# EAGLE design 42Board (EAGLE 9.6.2)
COMPANY: ADAFRUIT INDUSTRIES; DRAWN: KTOWN; REV: B
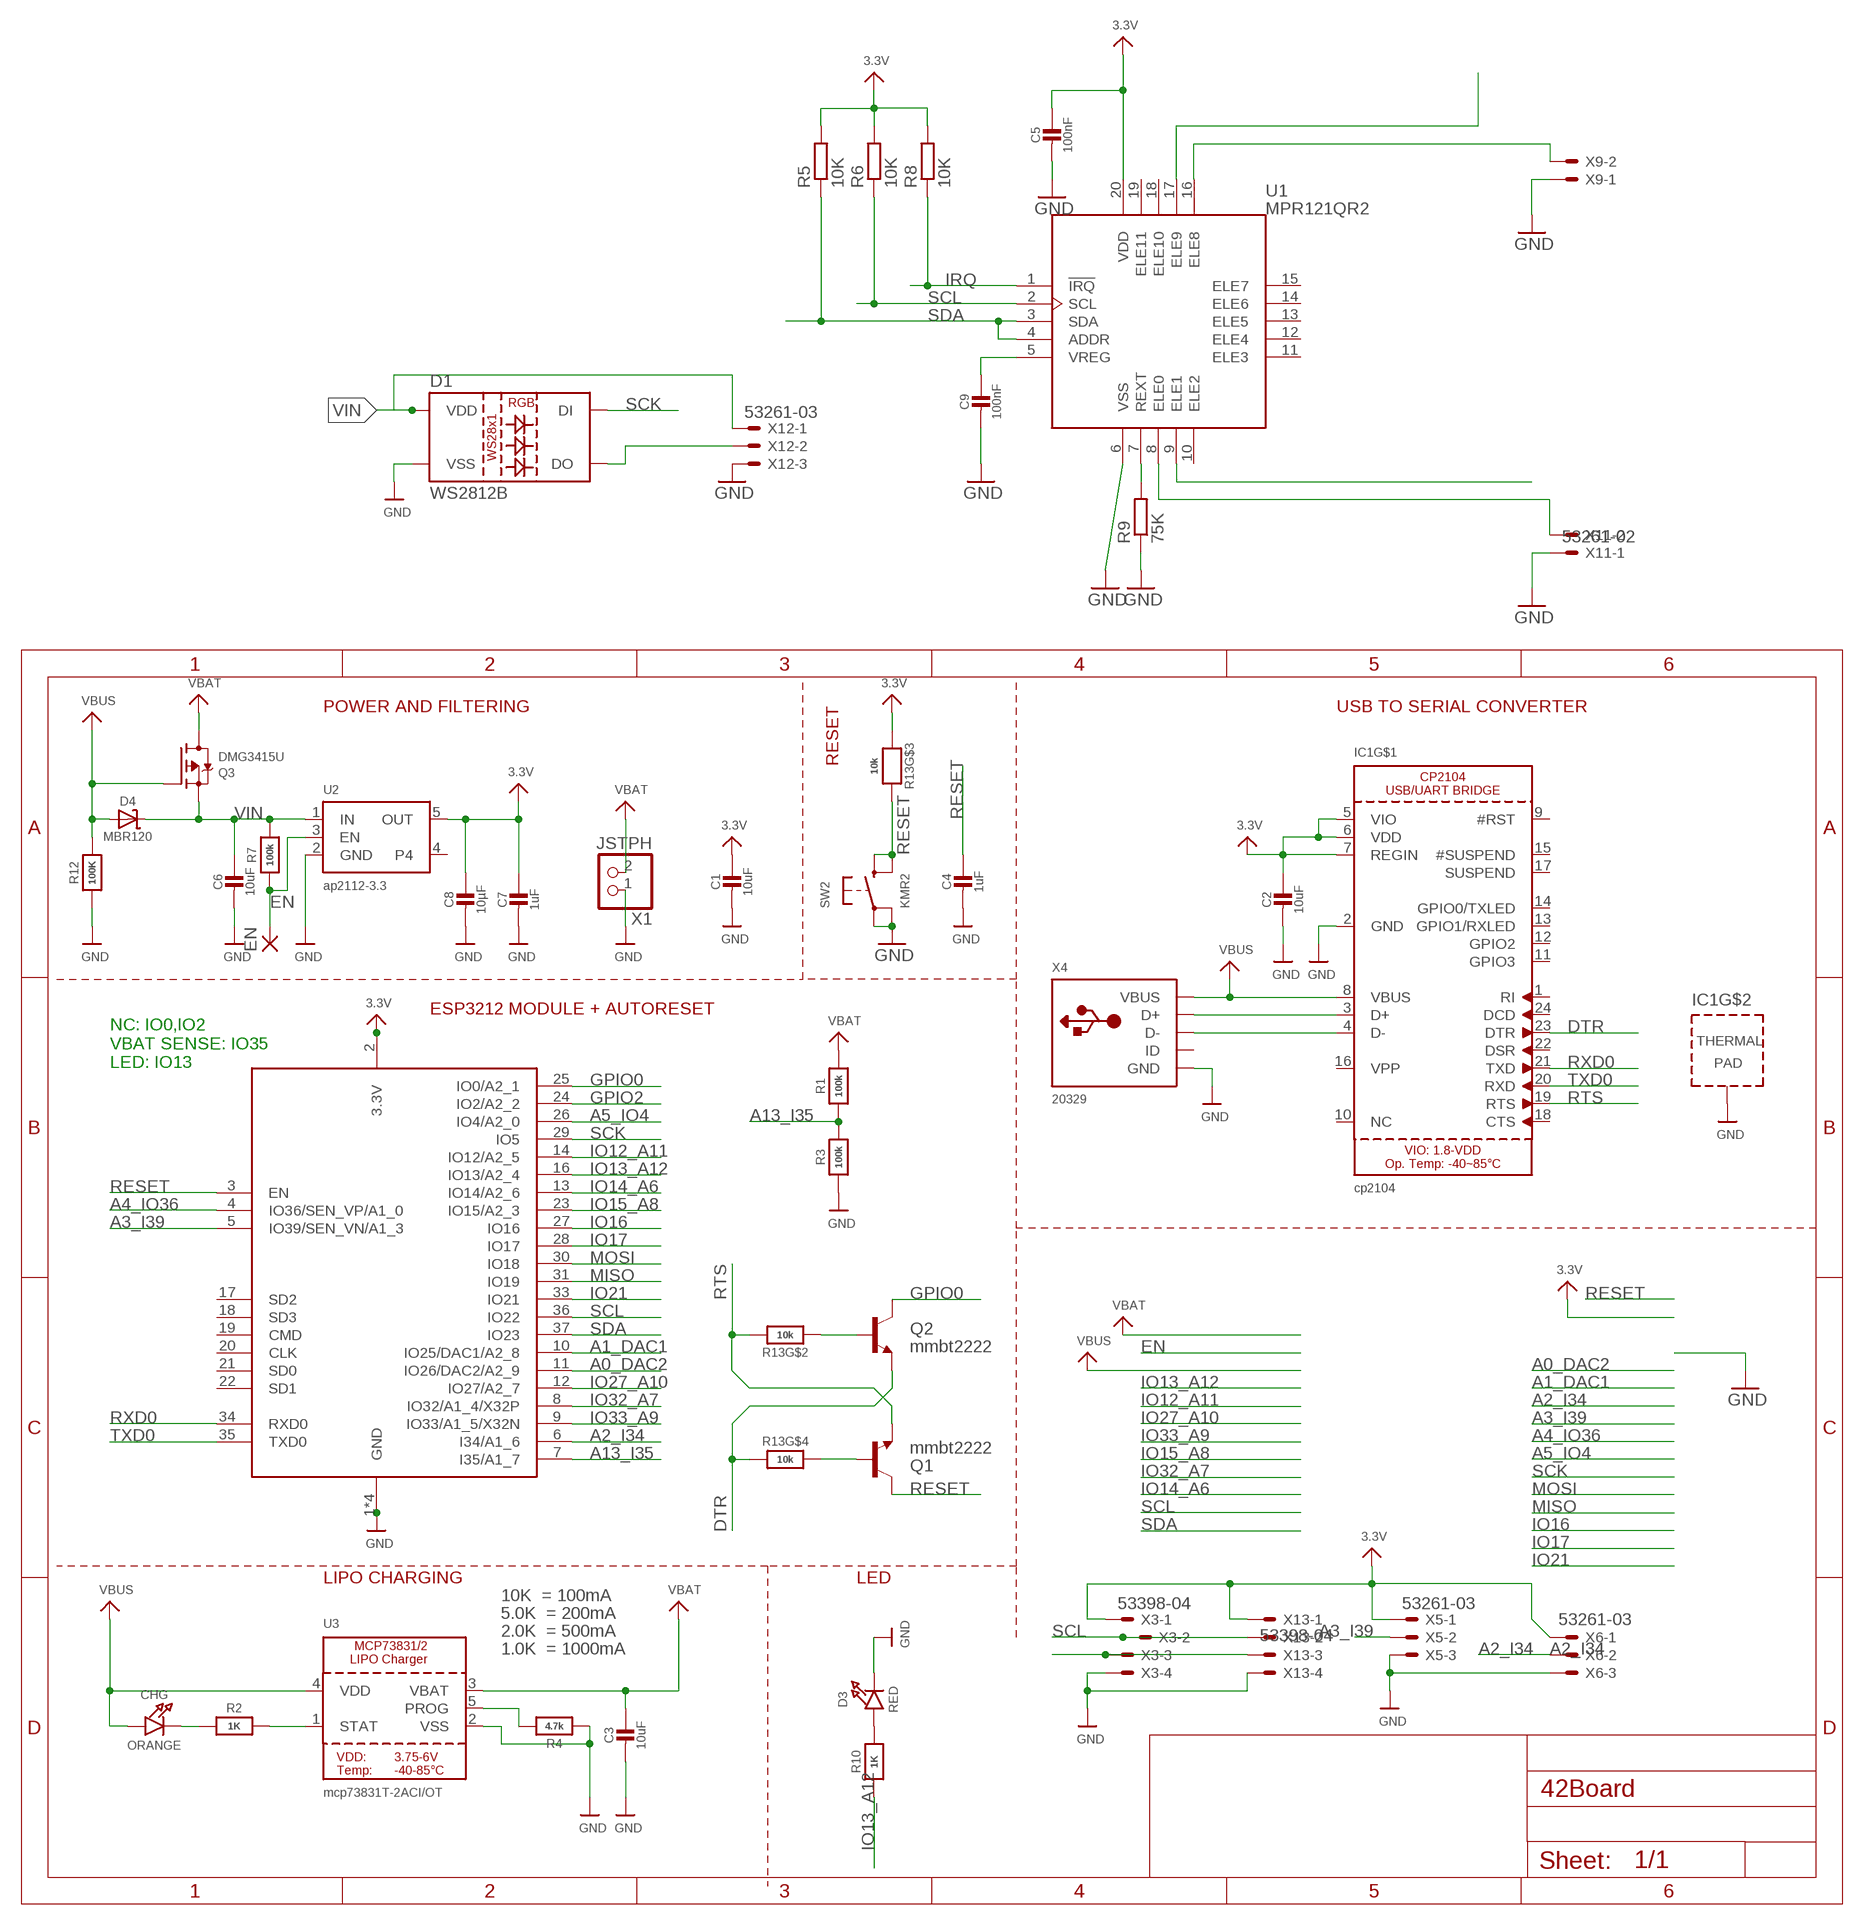
[diagram p0: schematic, sheet 1]

## Parts
C1  10uF  CAP_CERAMIC0805-NOOUTLINE  [0805-NO]
C2  10uF  CAP_CERAMIC0805-NOOUTLINE  [0805-NO]
C3  10uF  CAP_CERAMIC0805-NOOUTLINE  [0805-NO]
C4  1uF  CAP_CERAMIC0603_NO  [0603-NO]
C5  100nF  CAP_CERAMIC0603_NO  [0603-NO]
C6  10uF  CAP_CERAMIC0805-NOOUTLINE  [0805-NO]
C7  1uF  CAP_CERAMIC0603_NO  [0603-NO]
C8  10µF  CAP_CERAMIC0805-NOOUTLINE  [0805-NO]
C9  100nF  CAP_CERAMIC0603_NO  [0603-NO]
CHG  ORANGE  LED0805_NOOUTLINE  [CHIPLED_0805_NOOUTLINE]
D1  WS2812B  [WS2812B]
D3  RED  LED0805_NOOUTLINE  [CHIPLED_0805_NOOUTLINE]
D4  MBR120  DIODE-SCHOTTKYSOD-123  [SOD-123]
EN  1,6/0,8  [1,6/0,8]
IC1  cp2104  CP2104  [QFN24_4MM_SMSC]
Q1  mmbt2222  TRANSISTOR_NPNSOT23-3  [SOT23-3]
Q2  mmbt2222  TRANSISTOR_NPNSOT23-3  [SOT23-3]
Q3  DMG3415U  MOSFET-P  [SOT23-R]
R1  100k  RESISTOR_0603_NOOUT  [0603-NO]
R2  1K  RESISTOR_0603_NOOUT  [0603-NO]
R3  100k  RESISTOR_0603_NOOUT  [0603-NO]
R4  4.7k  RESISTOR_0603_NOOUT  [0603-NO]
R5  10K  R-EU_R0603  [R0603]
R6  10K  R-EU_R0603  [R0603]
R7  100k  RESISTOR_0603_NOOUT  [0603-NO]
R8  10K  R-EU_R0603  [R0603]
R9  75K  R-EU_R0603  [R0603]
R10  1K  RESISTOR_0603_NOOUT  [0603-NO]
R12  100K  RESISTOR_0603_NOOUT  [0603-NO]
R13  10k  RESISTOR_4PACK  [RESPACK_4X0603]
SW2  KMR2  SWITCH_TACT_SMT4.6X2.8  [BTN_KMR2_4.6X2.8]
U1  MPR121QR2  [UFQFN-20]
U2  ap2112-3.3  VREG_SOT23-5  [SOT23-5]
U3  mcp73831T-2ACI/OT  MCP73831/2  [SOT23-5]
X1  JSTPH  CON_JST_PH_2PIN  [JSTPH2]
X2  ESP32_WROOM32_SKINNY  [WROOM32_SKINNY]
X3  53398-04  [53398-04]
X4  20329  USB_MICRO_20329_V2  [4UCONN_20329_V2]
X5  53261-03  [53261-03]
X6  53261-03  [53261-03]
X9  53261-02  [53261-02]
X11  53261-02  [53261-02]
X12  53261-03  [53261-03]
X13  53398-04  [53398-04]

## Nets
3.3V: C1.1 C2.1 C5.1 C7.1 C8.1 IC1.5(VIO) IC1.6(VDD) IC1.7(REGIN) R5.2 R6.2 R8.2 R13.3 U1.20(VDD) U2.5(OUT) X2.2(3.3V) X3.1 X5.1 X6.1 X13.1
A0_DAC2: X2.11(IO26/DAC2/A2_9)
A1_DAC1: X2.10(IO25/DAC1/A2_8)
A2_I34: X2.6(I34/A1_6) X6.2
A3_I39: X2.5(IO39/SEN_VN/A1_3) X5.2
A4_IO36: X2.4(IO36/SEN_VP/A1_0)
A5_IO4: X2.26(IO4/A2_0)
A13_I35: R1.1 R3.2 X2.7(I35/A1_7)
DTR: IC1.23(DTR) Q2.2(E) R13.4
EN: EN.1(P) R7.1 U2.3(EN)
GND: C1.2 C2.2 C3.2 C4.2 C5.2 C6.2 C7.2 C8.2 C9.2 D1.3(VSS) D3.C IC1.2(GND) IC1.THERM(TP) R3.1 R4.1 R9.1 R12.1 SW2.A'(P1) SW2.A(P) U1.6(VSS) U2.2(GND) U3.2(VSS) X1.1 X2.1(GND) X2.15(GND) X2.38(GND) X2.P$1(GND) X3.4 X4.BASE@1(GND) X4.BASE@2(GND) X4.GND X4.SPRT@1(GND) X4.SPRT@2(GND) X4.SPRT@3(GND) X4.SPRT@4(GND) X5.3 X6.3 X9.1 X11.1 X12.3 X13.4
GPIO0: Q2.3(C) X2.25(IO0/A2_1)
GPIO2: X2.24(IO2/A2_2)
IO12_A11: X2.14(IO12/A2_5)
IO13_A12: R10.1 X2.16(IO13/A2_4)
IO14_A6: X2.13(IO14/A2_6)
IO15_A8: X2.23(IO15/A2_3)
IO16: X2.27(IO16)
IO17: X2.28(IO17)
IO21: X2.33(IO21)
IO27_A10: X2.12(IO27/A2_7)
IO32_A7: X2.8(IO32/A1_4/X32P)
IO33_A9: X2.9(IO33/A1_5/X32N)
IRQ: R8.1 U1.1(!IRQ)
MISO: X2.31(IO19)
MOSI: X2.30(IO18)
N$1: CHG.C R2.1
N$2: IC1.3(D+) X4.D+
N$3: R2.2 U3.1(STAT)
N$4: R4.2 U3.5(PROG)
N$5: D3.A R10.2
N$6: IC1.4(D-) X4.D-
N$7: D1.2(DO) X12.2
N$8: R9.2 U1.7(REXT)
N$9: U1.8(ELE0) X11.2
N$10: C9.1 U1.5(VREG)
N$11: U1.9(ELE1)
N$12: Q1.1(B) R13.5
N$13: Q2.1(B) R13.2
N$14: U1.16(ELE8) X9.2
N$15: U1.17(ELE9)
RESET: C4.1 Q1.3(C) R13.6 SW2.B'(S1) SW2.B(S) X2.3(EN)
RTS: IC1.19(RTS) Q1.2(E) R13.7
RXD0: IC1.21(TXD) X2.34(RXD0)
SCK: D1.4(DI) X2.29(IO5)
SCL: R6.1 U1.2(SCL) X2.36(IO22) X3.2 X13.2
SDA: R5.1 U1.3(SDA) U1.4(ADDR) X2.37(IO23) X3.3 X13.3
TXD0: IC1.20(RXD) X2.35(TXD0)
VBAT: C3.1 Q3.3(D) R1.2 U3.3(VBAT) X1.2
VBUS: CHG.A D4.A IC1.8(VBUS) Q3.1(G) R12.2 U3.4(VDD) X4.VBUS
VIN: C6.1 D1.1(VDD) D4.C Q3.2(S) R7.2 U2.1(IN) X12.1
Unconnected: IC1.1(RI) IC1.9(#RST) IC1.10(NC) IC1.11(GPIO3) IC1.12(GPIO2) IC1.13(GPIO1/RXLED) IC1.14(GPIO0/TXLED) IC1.15(#SUSPEND) IC1.16(VPP) IC1.17(SUSPEND) IC1.18(CTS) IC1.22(DSR) IC1.24(DCD) R13.1 R13.8 U1.10(ELE2) U1.11(ELE3) U1.12(ELE4) U1.13(ELE5) U1.14(ELE6) U1.15(ELE7) U1.18(ELE10) U1.19(ELE11) U2.4 X2.17(SD2) X2.18(SD3) X2.19(CMD) X2.20(CLK) X2.21(SD0) X2.22(SD1) X4.ID

## Notes on the sheet
- POWER AND FILTERING | USB TO SERIAL CONVERTER
- RESET
- ESP3212 MODULE + AUTORESET
- NC: IO0,IO2
  VBAT SENSE: IO35
  LED: IO13
- LIPO CHARGING | LED
- 10K  = 100mA
- 5.0K  = 200mA
- 2.0K  = 500mA
- 1.0K  = 1000mA

## Library data of the parts
C1-C9 = microbuilder:CAP_CERAMIC: Ceramic Capacitors For new designs, use the packages preceded by an '_' character since they are more reliable: The following footprints should be used on most boards: _0402 - Standard footprint for regular board layouts _0603 - Standard footprint for regular board layouts _0805 - Standard footprint for regular board layouts _1206 - Standard footprint for regular board layouts For extremely tight-pitch boards where space is at a premium, the following 'micro-pitch' footprints can be used (smaller pads, no silkscreen outline, etc.): _0402MP - Micro-pitch footprint for very dense/compact boards _0603MP - Micro-pitch footprint for very dense/compact boards _0805MP - Micro-pitch footprint for very dense/compact boards _1206MP - Micro-pitch footprint for very dense/compact boards
CHG D3 = microbuilder:LED: LED 0603 - 0603 Surface Mount Package 2mA: Green LED - Low Power (3.9mcd, 2ma, 1.7Vf) - Digikey: 475-2709-2-ND Orange LED - Low Power (9.8mcd, 2ma, 1.8Vf) - Digikey: 475-1194-2-ND Red LED - Low Power (5mcd, 2ma, 1.8Vf) - Digikey: 475-1195-2-ND Yellow LED - Low Power (7mcd, 2ma, 1.8Vf) - Digikey: 475-1196-2-ND 5mA: Blue LED - Low Power (17mcd, 5ma, 2.9Vf) - Digikey: LNJ937W8CRACT-ND 0805 - 0805 Surface Mount Package 2mA: Red LED (8.8mcd, 2mA, 1.8Vf, Clear) - Low Power [Digikey: 475-2510-1-ND] Green LED (5mcd, 2mA, 1.8Vf, Clear) - Low Power [Digikey: 475-2730-1-ND] Yellow LED (11.3mcd, 2mA, 1.8Vf, Clear) - Low Power [Digikey: 475-2555-1-ND] 20mA: Red LED (104mcd, 20mA, Diffused) - LS R976 [Digikey: 475-1278-6-ND] Red LED (12mcd, 20mA, 2.0Vf, Clear) - APT2012EC [Digikey: 754-1128-1-ND] Green LED (15mcd, 20mA, 2.2Vf, Clear) - APT2012GC [Digikey: 754-1131-1-ND] Orange LED (160mcd, 20mA, 2.1Vf, Clear) - APT2012SECK [Digikey: 754-1130-1-ND] 1206 - 1206 Surface Mount Package Green LED (26mcd, 20mA, Diffused) - LG N971 [Digikey: 475-1407-6-ND] Red LED (15mcd, 20mA, Diffused) - LH N974 [Digikey: 475-1416-6-ND] Cree - Cree High-Power Surface Mount LEDs XPEBWT-L1-0000-00D50 - White 111lm 350mA 2.9Vf 6200K 110° XTEAWT-00-0000-00000LEE3 - White 114lm 350mA 2.85Vf 5000K 115° Everlight - Everlight 45-21 Series Surface Mount LEDs 45-21/QK2C-B2832AC2CB2/2T - Warm White 2000mcd 20mA 3.25Vf 3050K 120° 45-21/LK2C-B38452C4CB2/2T - Nuetral White 2000mcd 20mA 3.25Vf 4150K 120° 45-21/LK2C-B50634C6CB2/2T - Cold White 2200mcd 20mA 3.25Vf 5650K 120° PLCC2 Reverse Mount LS T77K-J1L2-1-0-2-R18-Z - Red 11.25mcd 2mA 1.8Vf 630nm 120° LO T77K-L1M2-24-Z - Orange 19.6mcd 2mA 1.8Vf 606nm 120° LY T77K-K2M1-26-Z - Yellow 15.7mcd 2mA 1.8Vf 587nm 120°
D1 = SparkFun-LED:WS2812B: WS2812B SMD addressable RGB LED 5x5mm SMD LED with built-in controller IC. Color: Red/Green/Blue mC Rating: RGB: 390, 660, 180 mcd Forward Voltage: RGB: 2.0, 3.0, 3.0 V Packages:WS2812B SparkFun Products: Blynk Board - ESP8266 <https://www.sparkfun.com/products/13794>; PROD_ID: DIO-12503
D4 = microbuilder:DIODE-SCHOTTKY
EN = wirepad:1,6/0,8: THROUGH-HOLE PAD
IC1 = microbuilder:CP2104: CP2104 - USB to UART Bridge VDD Output: 3.45V
Q1 Q2 = SparkFun:TRANSISTOR_NPN: Transistor NPN BJT configuration in SOT23 package. MMBT2222 is the common NPN we use. Double check BCE configuration again layout.
Q3 = microbuilder:MOSFET-P: P-Channel Mosfet LEGEND VDS: Voltage Drain-Source ID: Drain Current RDS(ON): Drain-Source On-State Resistance VGS(TH): Gate-Source Threshold Voltage CISS: Drain-Source Input Capacitance SOT-23 Name VDS ID RDS(ON) VGS(TH) CISS Order Number IRLML5103 30V 760mA 600 mOhm -- 75pF @ 25V Digikey: IRLML5103PBFCT-ND IRLML6401 12V 4.3A 50 mOhm 950mV @ 250µA 830pF @ 10V Digikey: IRLML6401PBFTR-ND NTR0202PL 20V 400mA 800 mOhm 2.3V @ 250uA 70pF @ 5V Digikey: NTR0202PLT1GOSTR-ND NTR4101PT1G 20V 1.8A 85 mOhm 1.2V @ 250uA 675pF @ 10V Digikey: NTR4101PT1GOSCT-ND DMP2004K 20V 600mA 900 mOhm 1V @ 250uA 175pF @ 16V Digikey: DMP2004KDICT-ND PMV65XP 20V 3.9A 76 mOhm 950mV @ 1mA 725pF @ 20V Digikey: 568-2358-2-ND TO-252 Name VDS ID RDS(ON) VGS(TH) CISS Order Number AOD417 30V 25A 34 mOhm 3V @ 250µA 920pF @ 15V Digikey: 785-1106-2-ND PowerPak Name VDS ID RDS(ON) VGS(TH) CISS Order Number AON7401 30V 12A 14 mOhm 3V @ 250µA 2600pF @ 15V Digikey: 785-1302-1-ND
R1-R4 R7 R10 R12 = microbuilder:RESISTOR: Resistors For new designs, use the packages preceded by an '_' character since they are more reliable: The following footprints should be used on most boards: _0402 - Standard footprint for regular board layouts _0603 - Standard footprint for regular board layouts _0805 - Standard footprint for regular board layouts _1206 - Standard footprint for regular board layouts For extremely tight-pitch boards where space is at a premium, the following 'micro-pitch' footprints can be used (smaller pads, no silkscreen outline, etc.): _0402MP - Micro-pitch footprint for very dense/compact boards _0603MP - Micro-pitch footprint for very dense/compact boards _0805MP - Micro-pitch footprint for very dense/compact boards _1206MP - Micro-pitch footprint for very dense/compact boards
R5 R6 R8 R9 = rcl:R-EU_: RESISTOR, European symbol; SPICEPREFIX: R
R13 = microbuilder:RESISTOR_4PACK: Resistor Packs (4 resistors) 4 x 0603 10K 1/16W - Digikey: YC164J-10KCT-ND
SW2 = microbuilder:SWITCH_TACT_SMT: SMT Tact Switches 6x6mm - Digikey: P12940SCT-ND KMR2 (4.6x2.8mm) - Digikey: 401-1426-1-ND EVQ-PQHB55 - Light Touch, 160GF (4.5x4.5mm) - Digikey: P8090SCT-ND KMT0 - KMT021 NGJ LHS (etc.) IP68/Waterproof - Digikey: CKN10289CT-ND
U1 = Sensor:MPR121QR2: IC CTLR TOUCH SENSOR 20-QFN Manufacturer's datasheet <https://www.nxp.com/docs/en/data-sheet/MPR121.pdf>; CREATED_BY: PCBLayout.com; DIGI_KEY_PART_NUMBER: MPR121QR2TR-ND; MANUFACTURER: NXP USA Inc.; MPN: MPR121QR2; PACKAGE: 20-UFQFN
U2 = microbuilder:VREG_SOT23-5: SOT23-5 Fixed Voltage Regulators Part Current Out V Out V In V Dropout θJA (°C/W) TJ (°C) Digikey Part No. ADP121 150mA 3.3V 3.4-5.5V 0.09V @ 150mA -- -- ADP121-AUJZ33R7CT-ND ADP121 150mA 3.0V 3.1-5.5V 0.09V @ 150mA -- -- ADP121-AUJZ30R7CT-ND ADP122 300mA 3.3V 3.4-5.5V 0.085V @ 300mA -- -- ADP122AUJZ-3.3-R7CT-ND ADP1712 300mA 3.3V 3.5-5.5V 0.17V @ 300mA -- -- ADP1712AUJZ-3.3-R7TR-ND AP7311 (Low Cost) 150mA 3.3V 3.5-6V 0.15V @ 150mA -- -- AP7311-33WG-7DICT-ND LD39015M18R 150mA 1.8V 1.9V-5.5V 0.08V @ 100mA -- -- 497-6977-1-ND LP2985A-33DBVR 150mA 3.3V 3.3-16V 0.28V @ 150mA 206 150 296-18479-1-ND MCP1824T-3302E/OT 300mA 3.3V 3.5V-6V 0.2V @ 300mA -- -- MCP1824T-3302E/OTCT-ND MIC5205-2.5YM5 TR 150mA 2.5V 2.7-16V 0.165V @ 150mA -- -- 576-1257-2-ND MIC5205-3.0YM5 TR 150mA 3.0V 3.2V-16V 0.165V @ 150mA -- -- 576-1258-2-ND MIC5205-3.3YM5 TR 150mA 3.3V 3.5V-16V 0.165V @ 150mA -- -- 576-1259-2-ND TPS780330220 150mA 3.3V+2.2V 3.6-5.5V 250mV Max -- -- 296-23332-1-ND TDA3663/N1,135 100mA 3.3V 3.5-45V 0.18V @ 50mA -- -- 568-5343-1-ND Max operating temp can be calculated using θJA, TJ (max junction temperature), and power in watts. Set the "Maximum Ambient Temperature" until it reaches TJ ("Max Junction Temperature"), which is the absolute limit for safe use of the regulator: Heat Sink Temperature Calculator <http://www.daycounter.com/Calculators/Heat-Sink-Temperature-Calculator.phtml> For example, With 12V source into a 3.3V LP2985 and a 30mA load, we are dissipating (12V-3.3V) * 0.03A = 0.261W. With a θJA of 206 °C/W, a TJ of 150°C, and 261mW we can safely use the chip without a heat sink up to 75°C (=147.1°C Junction Temperature).
U3 = microbuilder:MCP73831/2: MCP73831/2 LIPO Charger VDD: 3.75 - 6V Temp -40 - 85°C Programmable Charge Rate: 15-500mA NOTE: STAT is a tri-state logic output on the MCP73831 and an open-drain output on the MCP73832. SOT23-5 with 4.2V output and tri-state logic on STAT = MCP73831T-2ACI/OT
X1 = microbuilder:CON_JST_PH_2PIN: JST 2-Pin Right-Angle Connector PH-Series - 4UConnector: 17311 SH-Series - 4UConnector: 07278
X2 = microbuilder:ESP32_WROOM32
X3 X13 = con-molex:53?-04: CONNECTOR wire to board 1.25 mm (.049 inch) pitch header; MF: MOLEX; OC_FARNELL: 1125367; OC_NEWARK: unknown
X4 = microbuilder:USB: USB Connectors USBMINIB - Surface Mount Female Mini-B USB Connector 4UConnector: 06564
X5 X6 X12 = con-molex:53?-03: CONNECTOR wire to board 1.25 mm (.049 inch) pitch header; MF: MOLEX; MPN: 53261-0390; OC_FARNELL: 1125359; OC_NEWARK: 57H5006
X9 X11 = con-molex:53?-02: CONNECTOR wire to board 1.25 mm (.049 inch) pitch header; MF: MOLEX; OC_FARNELL: 1125373; OC_NEWARK: unknown

## Board
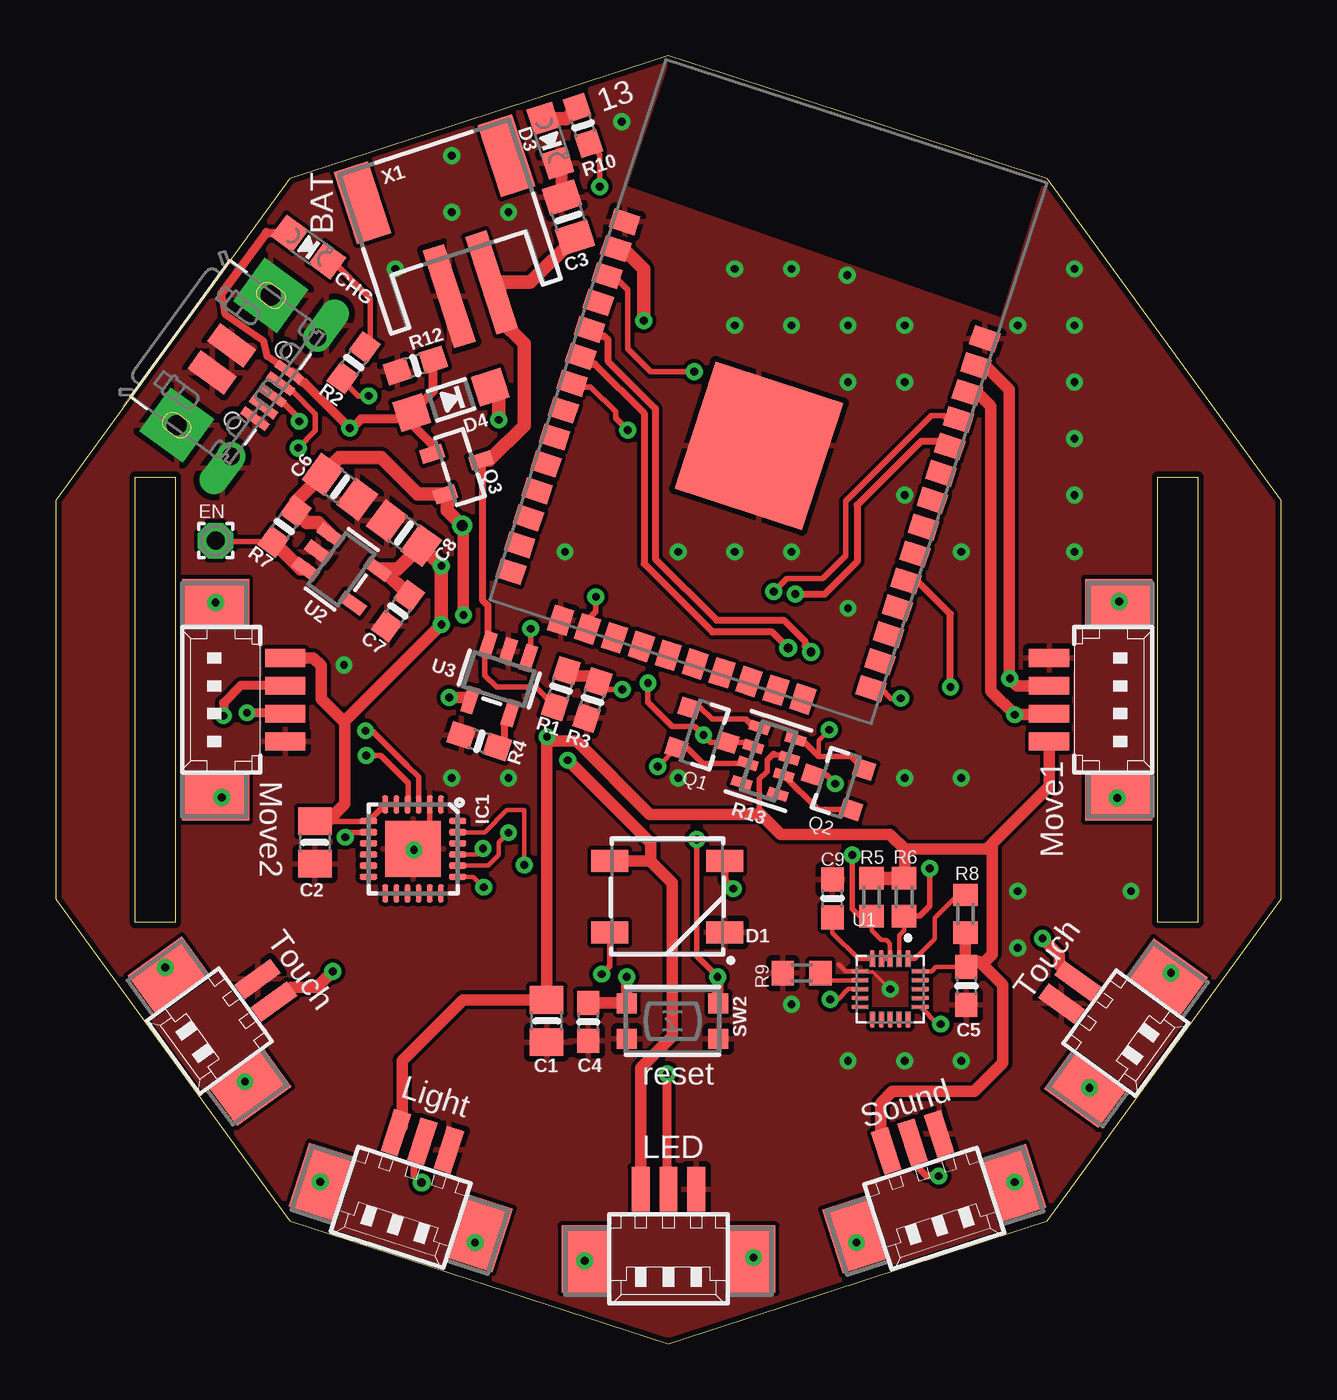
[diagram p1: board, top side]
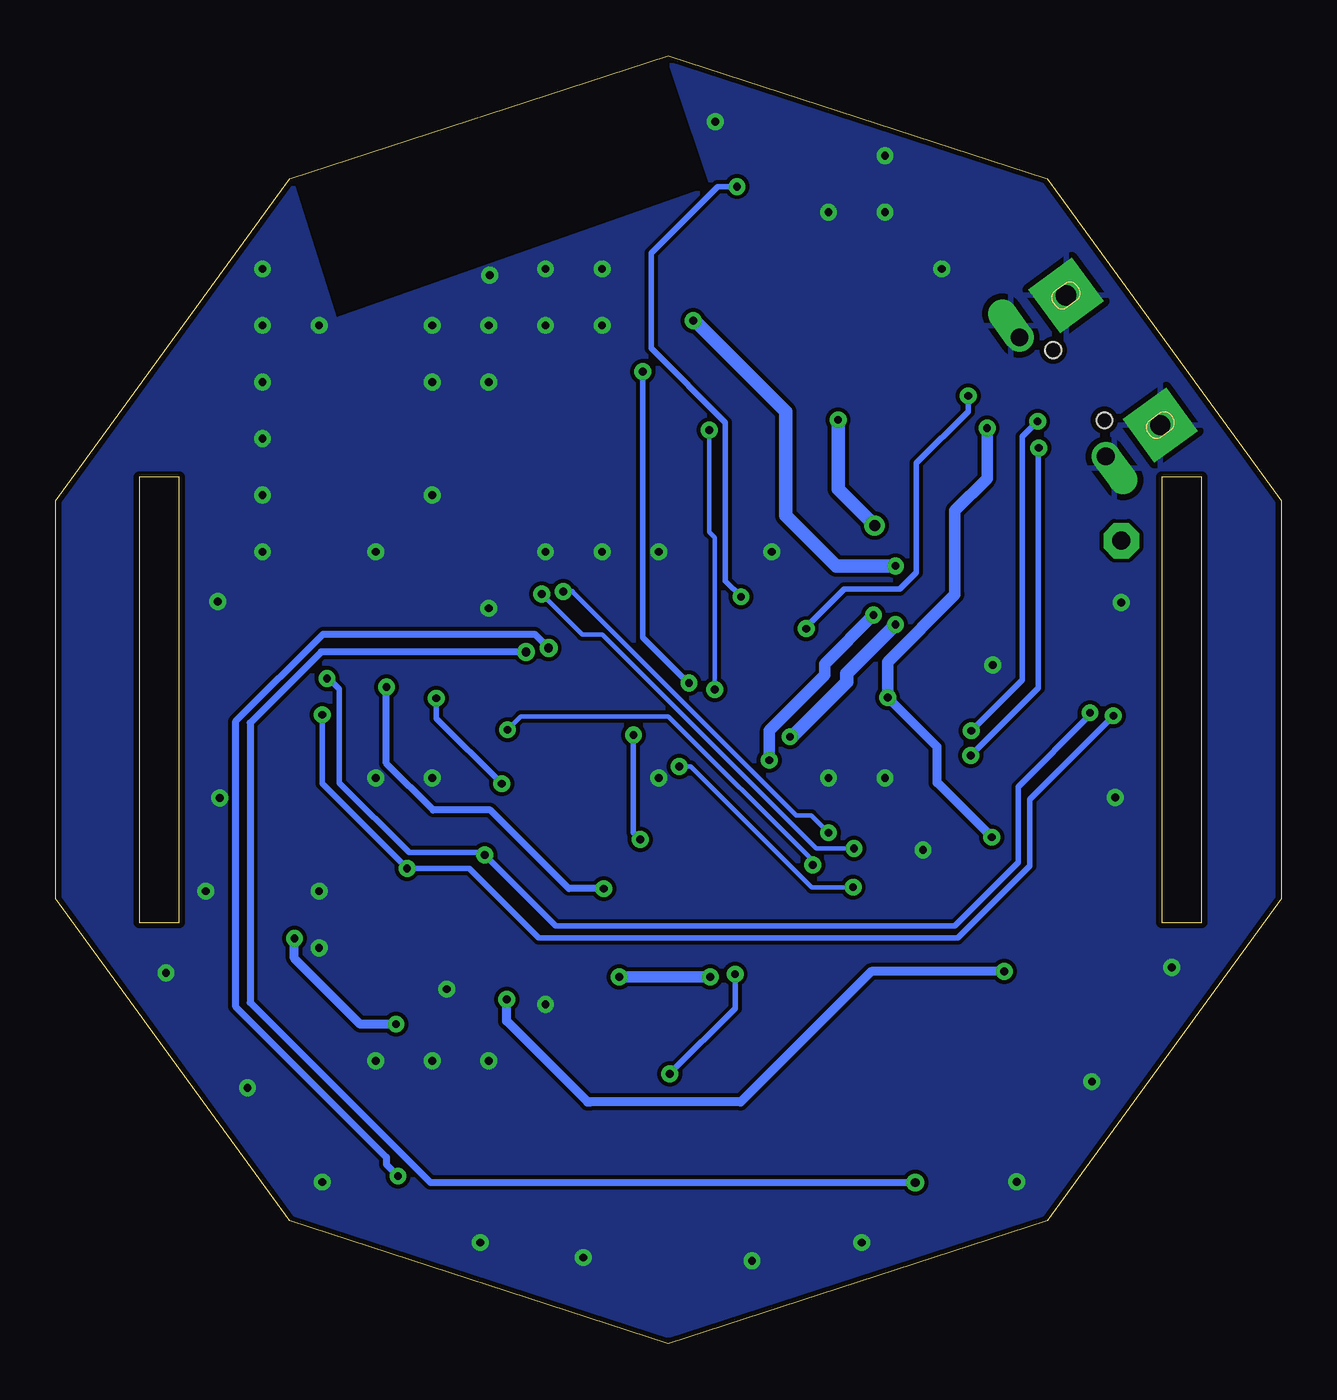
[diagram p2: board, bottom side, seen from below]

Size 55 x 57.83 mm. Coordinates in mm from the lower left corner, seen from the top.
Outline: 49.46,38.91 51.26,38.91 51.26,18.91 49.46,18.91 49.46,38.91
Outline: 5.37,18.91 3.57,18.91 3.57,38.91 5.37,38.91 5.37,18.91
Outline: 55,19.98 55,37.85 44.5,52.31 27.5,57.83 10.5,52.31 0,37.85 0,19.98 10.5,5.52 27.5,0 44.5,5.52 55,19.98
Copper layers (1*16): Top 0.035mm / dielectric 1.5mm / Bottom 0.035mm
Design rules "adafruit 7-7 *": minimum track width 6mil, minimum drill 15.5mil, track to track 7mil, track to pad 6mil, pad to pad 7mil, via to via 7mil, smd to smd 7mil, copper to edge 10mil, drill to drill 8mil, minimum pad ring 10mil, minimum via ring 8mil, stop-mask expansion 2mil, vias tented up to drill 20mil, thermal gap 10mil

### Footprints (pad centres in the part's own frame; a part is rotated, then mirrored left to right if it is on the bottom)
0805-NO = smd 1.24 x 1.5: 1 -0.95,0; 2 0.95,0
0603-NO = smd 1.075 x 1: 1 -0.85,0; 2 0.85,0
CHIPLED_0805_NOOUTLINE = smd 1.2 x 1.2: A 0,-1.05; C 0,1.05
WS2812B = smd 1.651 x 1: 1 2.577,-1.6; 2 2.577,1.6; 3 -2.577,1.6; 4 -2.577,-1.6
SOD-123 = smd 1.4 x 1.4: A 1.85,0; C -1.85,0
1,6/0,8 = drill 0.813 pad 1.6 octagon: 1 0,0
QFN24_4MM_SMSC = smd 0.8 x 0.28: 1 -2,1.25; 2 -2,0.75; 3 -2,0.25; 4 -2,-0.25; 5 -2,-0.75; 6 -2,-1.25; 13 2,-1.25; 14 2,-0.75; 15 2,-0.25; 16 2,0.25; 17 2,0.75; 18 2,1.25 | smd 0.28 x 0.8: 7 -1.25,-2; 8 -0.75,-2; 9 -0.25,-2; 10 0.25,-2; 11 0.75,-2; 12 1.25,-2; 19 1.25,2; 20 0.75,2; 21 0.25,2; 22 -0.25,2; 23 -0.75,2; 24 -1.25,2 | smd 2.5 x 2.5: THERM 0,0
SOT23-3 = smd 0.8 x 0.9: 1 -0.95,-1; 2 0.95,-1; 3 0,1.1
SOT23-R = smd 0.635 x 1.016: 1 -0.95,-1; 2 0.95,-1; 3 0,1
R0603 = smd 1 x 1.1: 1 -0.85,0; 2 0.85,0
RESPACK_4X0603 = smd 0.45 x 0.9: 1 -1.3,-0.85; 2 -0.4,-0.85; 3 0.4,-0.85; 4 1.3,-0.85; 5 1.3,0.85; 6 0.4,0.85; 7 -0.4,0.85; 8 -1.3,0.85
BTN_KMR2_4.6X2.8 = smd 0.9 x 0.9: A 2.05,0.8; A' -2.05,0.8; B 2.05,-0.8; B' -2.05,-0.8
UFQFN-20 = smd 0.22 x 0.76: 1 -0.8,-1.365; 2 -0.4,-1.365; 3 0,-1.365; 4 0.4,-1.365; 5 0.8,-1.365; 11 0.8,1.365; 12 0.4,1.365; 13 0,1.365; 14 -0.4,1.365; 15 -0.8,1.365 | smd 0.76 x 0.22: 6 1.365,-0.8; 7 1.365,-0.4; 8 1.365,0; 9 1.365,0.4; 10 1.365,0.8; 16 -1.365,0.8; 17 -1.365,0.4; 18 -1.365,0; 19 -1.365,-0.4; 20 -1.365,-0.8
SOT23-5 = smd 0.55 x 1.2: 1 -0.95,-1.3; 2 0,-1.3; 3 0.95,-1.3; 4 0.95,1.3; 5 -0.95,1.3
JSTPH2 = smd 1 x 4.6: 1 -1,-3.7; 2 1,-3.7 | smd 1.6 x 3.4: NC1 -3.4,1.5; NC2 3.4,1.5
WROOM32_SKINNY = smd 1.2 x 0.9: 1 -8.5,5; 2 -8.5,3.73; 3 -8.5,2.46; 4 -8.5,1.19; 5 -8.5,-0.08; 6 -8.5,-1.35; 7 -8.5,-2.62; 8 -8.5,-3.89; 9 -8.5,-5.16; 10 -8.5,-6.43; 11 -8.5,-7.7; 12 -8.5,-8.97; 13 -8.5,-10.24; 14 -8.5,-11.51; 25 8.5,-11.51; 26 8.5,-10.24; 27 8.5,-8.97; 28 8.5,-7.7; 29 8.5,-6.43; 30 8.5,-5.16; 31 8.5,-3.89; 32 8.5,-2.62; 33 8.5,-1.35; 34 8.5,-0.08; 35 8.5,1.19; 36 8.5,2.46; 37 8.5,3.73; 38 8.5,5 | smd 0.9 x 1.2: 15 -5.7,-12.9; 16 -4.43,-12.9; 17 -3.16,-12.9; 18 -1.89,-12.9; 19 -0.62,-12.9; 20 0.65,-12.9; 21 1.92,-12.9; 22 3.19,-12.9; 23 4.46,-12.9; 24 5.73,-12.9 | smd 6 x 6: P$1 0.34,-2.7
53398-04 = smd 0.8 x 1.8: 1 1.875,-2.5; 2 0.625,-2.5; 3 -0.625,-2.5; 4 -1.875,-2.5 | smd 2.1 x 3: S1 4.375,0.625; S2 -4.375,0.625
4UCONN_20329_V2 = smd 1 x 2: BASE@1 -0.75,-2; BASE@2 0.75,-2 | smd 0.4 x 1.35: D+ 0,0.775; D- -0.65,0.775; GND 1.3,0.775; ID 0.65,0.775; VBUS -1.3,0.775 | drill 0.8 pad 1.143 offset: SPRT@1 -3.3,0.9; SPRT@2 3.3,0.9 | drill 0.9 pad 2.413 square: SPRT@3 -3.6,-1.9; SPRT@4 3.6,-1.9 | hole 0.7: -1.95,0; 1.95,0
53261-03 = smd 0.8 x 2: 1 1.25,-2.5; 2 0,-2.5; 3 -1.25,-2.5 | smd 2.1 x 3: S1 3.75,0.625; S2 -3.75,0.625
53261-02 = smd 0.8 x 2: 1 0.625,-2.5; 2 -0.625,-2.5 | smd 2.1 x 3: S1 3.125,0.625; S2 -3.125,0.625

### Placement (x,y rotation side)
C1  22.03,14.49 270 top
C2  11.63,22.5 270 top
C3  23.01,50.57 108 top
C4  23.9,14.45 270 top
C5  40.87,16.07 270 top
C6  12.76,38.48 324 top
C7  15.36,32.91 234 top
C8  15.63,36.39 144 top
C9  34.86,20 90 top
CHG  11.34,49.24 234 top
D1  27.44,20.07 180 top
D3  22.2,54.01 198 top
D4  17.74,42.38 198 top
EN  7.18,36.06 0 top
IC1  16.04,22.22 270 top
Q1  29.1,27.34 252 top
Q2  35.04,25.19 72 top
Q3  18.14,39.36 288 top
R1  22.67,29.41 252 top
R2  13.37,44.06 234 top
R3  24.09,28.9 72 top
R4  19.01,27.06 342 top
R5  36.61,20.05 90 top
R6  38.07,20.05 90 top
R7  10.26,36.7 54 top
R8  40.83,19.3 270 top
R9  33.48,16.65 0 top
R10  23.66,54.7 108 top
R12  16.14,43.92 18 top
R13  31.99,26.17 72 top
SW2  27.69,14.49 180 top
U1  37.45,15.93 180 top
U2  12.83,34.78 234 top
U3  19.9,29.85 162 top
X1  17.46,50.86 18 top
X2  32.07,42.99 342 top
X3  47.08,28.92 270 top
X4  9.08,43.04 234 top
X5  15.68,6.72 162 top
X6  39.23,6.67 198 top
X9  47.52,14.31 234 top
X11  7.4,14.4 126 top
X12  27.5,4.45 180 top
X13  7.81,28.92 90 top

### Tracks (layer width: path | path; a pad name or v marks a point on that pad's centre or on a via)
3.3V  (via drill 0.35)
  Top 0.203: U1.20 39.31,16.73 39.5,16.92 C5.1
  Top 0.254: R13.3 32.78,26.43 32.28,26.43 32.22,26.49 31.93,26.2 31.93,25.7 31.58,25.36 31.58,23.82 31.64,23.77 32.54,22.87 | C2.1 14.03,23.45 IC1.7 IC1.6 IC1.5
  Top 0.508: X5.1 15.55,9.76 15.55,12.7 18.28,15.44 C1.1 22.03,27.24 v22.05,27.25 22.24,27.06 23.38,27.06 26.67,23.77 31.64,23.77 | 12.98,27.96 12.98,24.23 12.2,23.45 C2.1 | 12.98,27.96 v17.31,32.3 | 38.1,22.21 37.44,22.87 32.54,22.87 31.58,23.82 | 38.1,22.21 38.1,20.93 R6.2 | X3.1 44.58,25.02 42.02,22.47 | 38.1,22.21 41.77,22.21 42.02,22.47 | 41.58,17.04 42.51,16.12 42.51,12.61 41.22,11.33 37.55,11.33 37.02,10.79 37.02,8.91 X6.1 | 41.58,17.04 41.45,17.17 41.12,17.17 C5.1 40.83,16.95 R8.2 | 42.02,22.47 42.02,17.49 41.58,17.04 | X13.1 11.56,30.79 11.91,30.44 11.91,28.96 12.9,27.96 12.98,27.96
  Top 0.61: C7.1 14.67,34.78 U2.5 15.35,34.78 C8.1 v17.31,34.93 v17.31,34.92 v17.31,32.3 | X2.2 25.34,48.96 25.68,48.96 26.39,48.25 v26.39,45.94 | R5.2 R6.2
  Bottom 0.61: v17.31,34.92 19.98,34.92 22.24,37.19 22.24,41.85 26.33,45.94 v26.39,45.94 | v22.05,27.25 21.96,27.25 19.51,29.7 19.51,30.1 v17.31,32.3
A1_DAC1
  Top 0.254: X2.10 22.14,39.36
A2_I34  (via drill 0.35, 0.39)
  Top 0.305: X2.6 23.91,43.99 24.2,43.99 26.4,41.78 26.4,35.03 29.48,31.95 32.17,31.95 v32.88,31.24 | v39.64,7.53 39.08,7.53 38.65,7.96 38.65,8.86 X6.2
  Bottom 0.305: v32.88,31.24 33.5,31.86 43,31.86 46.93,27.93 46.93,15.16 40.16,8.38 40.16,8.05 v39.64,7.53
A3_I39  (via drill 0.39)
  Top 0.305: X2.5 24.25,45.25 24.61,45.25 24.78,45.09 24.78,44.13 26.91,41.99 26.91,35.23 29.66,32.48 32.67,32.48 33.64,31.52 33.64,31.32 v33.9,31.06 | v16.42,7.24 16.09,7.57 16.09,8.26 16.46,8.63 X5.2
  Bottom 0.305: v33.9,31.06 43.08,31.06 46.27,27.87 46.27,15.32 38.19,7.24 v16.42,7.24
A13_I35  (via drill 0.35)
  Top 0.203: R3.2 24.69,29.38
  Top 0.254: v25.67,41.02 25.13,41.55 25.13,41.85 24.02,42.96 23.34,42.96 X2.7 | 24.69,29.38 v25.42,29.38
  Top 0.508: R3.2 24.08,29.98 23.17,29.98 R1.1
  Bottom 0.203: v25.42,29.38 25.42,36.21 25.67,36.45 v25.67,41.02
DTR  (via drill 0.35)
  Top 0.203: IC1.23 19.24,22.97 20.23,23.96 21.03,23.96 v21.03,21.5 | v34.72,27.57 34.24,27.09 34.24,26.37
  Top 0.254: R13.4 33.47,27.14 34.24,26.37 35.7,26.37 Q2.2
  Bottom 0.203: v34.72,27.57 34.12,28.17 27.51,28.17 21.03,21.69 v21.03,21.5
EN
  Top 0.254: EN.1 7.22,36.01 R7.1
  Top 0.61: U2.3 11,34.78 R7.1
GND  (via drill 0.35)
  Top 0.152: U1.6 36.12,16.69 36.66,16.69 37.43,15.93 v37.45,15.93
  Top 0.203: U1.6 35.46,16.73 35.14,17.04
  Top 0.254: IC1.2 16.79,23.3 16.67,23.19
  Top 0.508: D3.C 22.72,52.82 C3.2
  other vias: 30.48,48.26 17.78,25.4 20.32,25.4 22.86,35.56 16.08,22.17 27.94,25.4 30.48,45.72 35.56,45.72 38.1,45.72 38.1,43.18 33.02,45.72 30.48,35.56 40.64,35.56 27.94,35.56 33.02,35.56 35.56,43.18 35.56,33.02 43.18,45.72 45.72,45.72 45.72,43.18 45.72,40.64 45.72,38.1 45.72,35.56 25.4,54.86 17.78,50.8 17.78,53.34 20.32,50.8 15.24,48.26 12.94,30.48 38.1,25.4 40.64,25.4 43.18,20.32 43.18,17.78 48.26,20.32 40.64,12.7 38.1,12.7 35.56,12.7 33.02,15.24 33.02,48.26 35.52,47.98 45.72,48.26 38.1,38.1 31.32,3.87 35.94,4.55 43.04,7.26 46.39,11.49 50.05,16.65 23.75,3.72 18.82,4.55 11.87,7.28 8.5,11.77 4.91,16.9 7.45,24.52 7.18,33.27 47.73,33.32 47.64,24.51
  pour Bottom: 0.03,58.46 0.03,0.04 54.64,0.04 54.64,58.45 46.39,58.41 42.48,45.94 25.5,51.9 27.69,58.42 18.95,58.46
  pour Top: 0.03,58.46 0.03,0.04 54.64,0.04 54.64,58.45 46.39,58.41 42.48,45.94 25.5,51.9 27.69,58.42 18.95,58.46
GPIO0  (via drill 0.35)
  Top 0.254: Q2.3 34.6,25.53 v34.99,25.15 | v37.92,28.98 37.49,28.98 37.05,29.42 X2.25
  Bottom 0.254: v34.99,25.15 37.92,28.08 v37.92,28.98
IO13_A12  (via drill 0.35)
  Top 0.254: R10.1 24.42,53.39 v24.42,51.96 | v24.24,33.54 24.24,32.88 23.87,32.51 X2.16
  Bottom 0.254: v24.42,51.96 25.29,51.96 28.28,48.96 28.28,44.69 24.96,41.36 24.96,34.25 v24.24,33.54
IRQ
  Top 0.203: U1.1 38.56,17.29 39.45,18.17 39.45,19.12 40.47,20.15 R8.1
N$1
  Top 0.254: CHG.C 12.4,48.62 14.11,46.91 14.11,44.98 R2.1
N$2  (via drill 0.35)
  Top 0.254: X4.D+ 10.01,42.28 10.19,42.28 10.93,41.53 v10.93,41.41 | v13.91,27.52 14.21,27.52 15.79,25.95 16.29,25.44 IC1.3
  Bottom 0.254: v10.93,41.41 11.62,40.73 11.62,29.81 v13.91,27.52
N$3  (via drill 0.35)
  Top 0.254: R2.2 12.87,43.27 13.59,42.56 v14.05,42.56 | v21.32,32.11 21.32,30.91 U3.1
  Bottom 0.254: v14.05,42.56 14.05,41.86 16.37,39.53 16.37,34.63 17.12,33.88 19.62,33.88 21.32,32.18 v21.32,32.11
N$4
  Top 0.305: U3.5 20.4,28.05 20.12,27.77 20.12,27.21 19.82,26.91 R4.2
N$5
  Top 0.61: R10.2 22.9,55.01 D3.A
N$6  (via drill 0.35)
  Top 0.254: X4.D- 10.41,42.79 10.61,42.79 11.66,41.74 11.66,41 v10.88,40.22 | v13.93,26.42 14.58,26.42 15.81,25.18 15.81,24.24 IC1.4
  Bottom 0.254: v10.88,40.22 10.9,40.21 10.9,29.45 v13.93,26.42
N$7  (via drill 0.35)
  Top 0.254: D1.2 24.87,16.96 v24.51,16.6
  Top 0.406: X12.2 27.44,7 v27.44,12.12
  Bottom 0.254: v24.51,16.6 24.51,15.06 27.43,12.14 v27.43,12.13 v27.44,12.12
N$8
  Top 0.203: U1.7 36.08,16.32 33.85,16.32 R9.2
N$9  (via drill 0.35)
  Top 0.2: U1.8 35.57,15.93 35.11,15.47 v34.76,15.47 | 12.43,16.74 v12.43,16.71
  Top 0.508: X11.2 9.92,15.37 10.56,16 11.72,16 v12.43,16.71
  Bottom 0.305: 31.03,10.86 31.13,10.86
  Bottom 0.406: v12.43,16.71 18.4,16.71 24.26,10.86 31.03,10.86 | 31.13,10.86 34.76,14.49 v34.76,15.47
N$10
  Top 0.2: U1.5
  Top 0.203: C9.1 34.86,18.45 36.03,17.29 U1.5
  Top 0.254: U1.5
N$12
  Top 0.254: R13.5 31.36,27.67 30.98,28.05 29.45,28.05 28.96,28.55 Q1.1
N$13
  Top 0.254: Q2.1 34.22,23.98 R13.2
N$14  (via drill 0.35)
  Top 0.2: U1.16 39.59,14.35 v39.73,14.35
  Top 0.508: v44.28,18.2 45.05,17.44 45.05,16.98 45.74,16.29 X9.2
  Bottom 0.406: v44.28,18.2 44.28,17.31 41.33,14.35 v39.73,14.35
RESET  (via drill 0.35)
  Top 0.254: R13.6 31.12,27 Q1.3 29.4,27 v29.07,27.33 28.68,27.72 27.67,27.72 26.58,28.82 v26.58,29.67 | v29.7,16.47 28.76,17.41 v28.76,22.65 | X2.3 25.05,47.96 25.67,47.33 25.67,44.68 26.7,43.65 v28.65,43.65
  Top 0.508: C4.1 25.62,15.3 SW2.B v25.64,16.46 v25.63,16.47 | v29.7,16.47 29.7,15.32 SW2.B'
  Bottom 0.254: v29.07,27.33 29.07,22.95 v28.76,22.65 | v28.65,43.65 28.65,31.7 26.62,29.67 v26.58,29.67
  Bottom 0.508: v25.63,16.47 v29.7,16.47
RTS  (via drill 0.35)
  Top 0.203: IC1.19 18.75,20.97 v19.21,20.5 | v27.01,25.92 27.03,25.92 Q1.2
  Top 0.254: Q1.2 28.34,26.74 29.03,26.05 R13.7
  Bottom 0.203: v19.21,20.5 21.07,20.5 26.49,25.92 v27.01,25.92
RXD0  (via drill 0.35)
  Top 0.203: IC1.21 18.91,21.97 v19.18,22.24 | 35.97,37.66 35.98,37.67 | 39.56,40.53 39.8,40.29 X2.34
  Top 0.305: v33.18,33.66 34.51,33.66 35.97,35.12 35.97,37.66 | 35.98,37.67 38.84,40.53 39.56,40.53
  Bottom 0.203: v19.18,22.24 20.88,22.24 30.48,31.84 31.37,31.84 v33.18,33.66
SCK  (via drill 0.35)
  Top 0.305: D1.4 30.02,20.82 v30.4,20.43 | v40.16,29.49 40.16,32.77 38.68,34.25 X2.29
  Bottom 0.305: v30.4,20.43 31.97,20.43 35.5,23.96 38.06,23.96 40.16,26.06 v40.16,29.49
SCL  (via drill 0.35)
  Top 0.203: U1.2 37.85,18.35 38.07,18.57 R6.1
  Top 0.254: R6.1 38.77,19.2 39.23,19.66 v39.23,21.34
  Top 0.406: X13.2 10.28,29.57 8.33,29.57 7.53,28.78 v7.53,28.19
  Top 0.508: X2.36 41.36,42.7 41.97,42.09 41.97,29.31 v43.04,28.25 44.94,28.25 45.1,28.4 44.69,28.4 X3.2
  Bottom 0.254: v43.04,28.25 43.04,25.15 v39.23,21.34 36.44,21.34 33.32,18.22 14.52,18.22 11.29,21.45 11.29,24.43 v7.53,28.19
SDA  (via drill 0.35)
  Top 0.203: R5.1 36.61,18.57 37.05,18.14 37.27,18.14 37.44,17.97 37.44,17.3 U1.3 U1.4
  Top 0.254: R5.1 36.08,19.2 35.75,19.53 v35.75,21.95 | 9.85,28.41 9.78,28.33 v8.58,28.33
  Top 0.305: 10.27,28.33 X13.3
  Top 0.406: v8.58,28.33 10.27,28.33
  Top 0.508: X3.3 43.15,29.54 v42.82,29.87 42.79,29.91 42.79,42.85 41.73,43.91 X2.37
  Bottom 0.254: v42.82,29.87 42.74,29.87 42.27,29.4 42.27,25.18 39.14,22.06 35.86,22.06 v35.75,21.95 32.56,18.76 14.66,18.76 11.81,21.6 11.81,25.01 8.58,28.23 v8.58,28.33
TXD0  (via drill 0.35)
  Top 0.203: IC1.20 19.41,21.47 19.89,21.95 19.89,22.52 v20.32,22.95
  Top 0.254: X2.35 40.04,41.49 39.86,41.67 39.28,41.67 35.45,37.84 35.45,35.39 34.42,34.35 32.8,34.35 v32.22,33.77
  Bottom 0.203: v20.32,22.95 21.08,23.71 21.75,23.71 31.81,33.77
  Bottom 0.254: v32.22,33.77 31.81,33.77
VBAT
  Top 0.254: U3.3 19.27,31.25 19.27,30.01 19.8,29.48 21.53,29.48 R1.2
  Top 0.305: Q3.3 19.15,39.6 19.15,33.4 19.4,33.15 U3.3
  Top 0.61: C3.1 21.29,47.65 X1.2 19.94,47.27 19.94,45.98 21.02,44.9 21.02,41.22 19.47,39.67 Q3.3
VBUS  (via drill 0.35)
  Top 0.254: IC1.8 13.21,22.97 v12.99,22.75
  Top 0.305: X4.VBUS 9.49,44.34 9.35,45.01 7.61,46.2 7.45,47.14
  Top 0.406: X4.VBUS 10.61,43.64 11.09,43.15 11.16,43.15 v13.2,41.11 13.3,41.11 13.71,41.52 15.69,41.52 D4.A | D4.A 15.98,41.28 16.89,40.37 Q3.1 | D4.A 16.95,42.78 R12.2 | 10.19,49.85 CHG.A 9.46,49.89 7.45,47.14
  Top 0.508: U3.4 18.48,29.02 v17.67,29.02
  Bottom 0.203: 15.46,25.21 15.44,25.2
  Bottom 0.406: v17.67,29.02 15.46,26.81 15.46,25.21 | 15.44,25.2 v12.99,22.75
  Bottom 0.508: v17.67,29.02 17.67,30.62 14.64,33.64 14.64,37.41 13.2,38.86 v13.2,41.11
VIN  (via drill 0.35, 0.5)
  Top 0.2: D1.1 26.69,21.67
  Top 0.508: X12.1 26.25,12.38 27.67,13.8 27.67,20.69 26.69,21.67 26.69,22.48 v22.97,26.2 | 26.68,21.68 D1.1 | v18.3,32.72 18.29,32.73 18.29,36.7 v18.25,36.74
  Top 0.61: U2.1 11.77,36.88 11.27,36.88 R7.2 10.76,37.81 C6.1 12.73,39.78 14.62,39.78 16.25,38.15 Q3.2 17.58,38.04 17.58,37.41 v18.25,36.74 | D4.C 19.89,42.56 v19.89,41.48
  Bottom 0.508: v22.97,26.2 22.97,27.55 20.48,30.04 20.48,30.53 v18.3,32.72
  Bottom 0.61: v19.89,41.48 19.89,38.38 v18.25,36.74

### Text on the board
tPlace: 13 | BAT | Move2 | Move1 | Touch | Touch | reset | Sound | Light | LED